# EAGLE design brick_analog_vibrator (EAGLE 7.3.0)
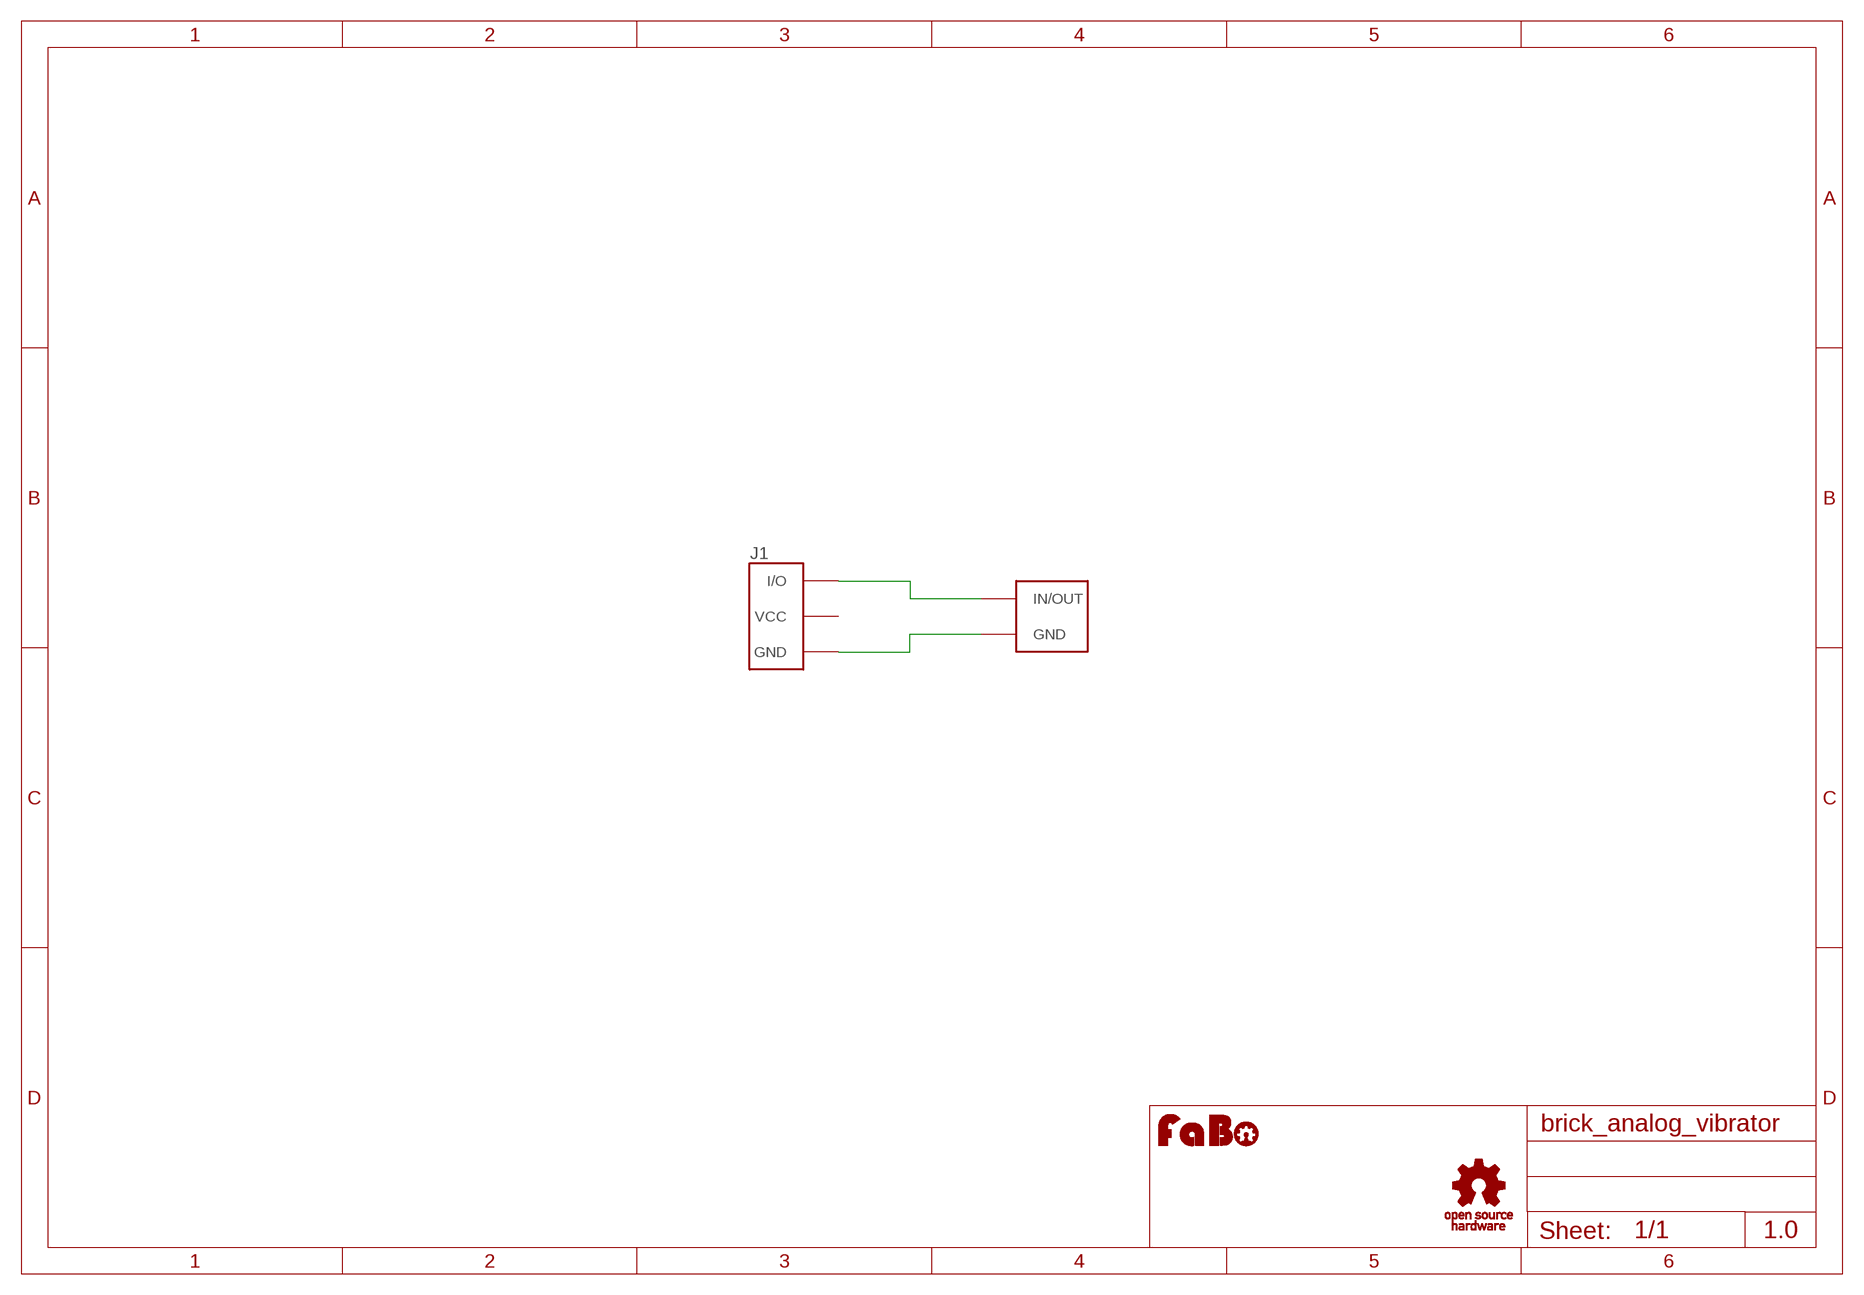
[diagram p0: schematic, sheet 1]

## Parts
J1  BRICK_3PIN_NORMAL  [BRICK_3PIN]
U1  LA3R5-480H1-PTH  [LA3R5-480AH1_PTH]
U$1  LOGO_FABO-M  [LOGO_FABO_M]
U$5  LOGO_OSHW_T-M  [LOGO_OSHW_T_M]

## Nets
GND: J1.GND U1.P$2(GND)
N$1: J1.IN/OUT(I/O) U1.P$1(IN/OUT)
Unconnected: J1.VCC

## Notes on the sheet
- 1.0

## Library data of the parts
J1 = gclue:BRICK_3PIN: FaBo Brick 3pin
U1 = gclue:LA3R5-480H1
U$1 = FaBo:LOGO_FABO
U$5 = gclue:LOGO_OSHW_T

## Board
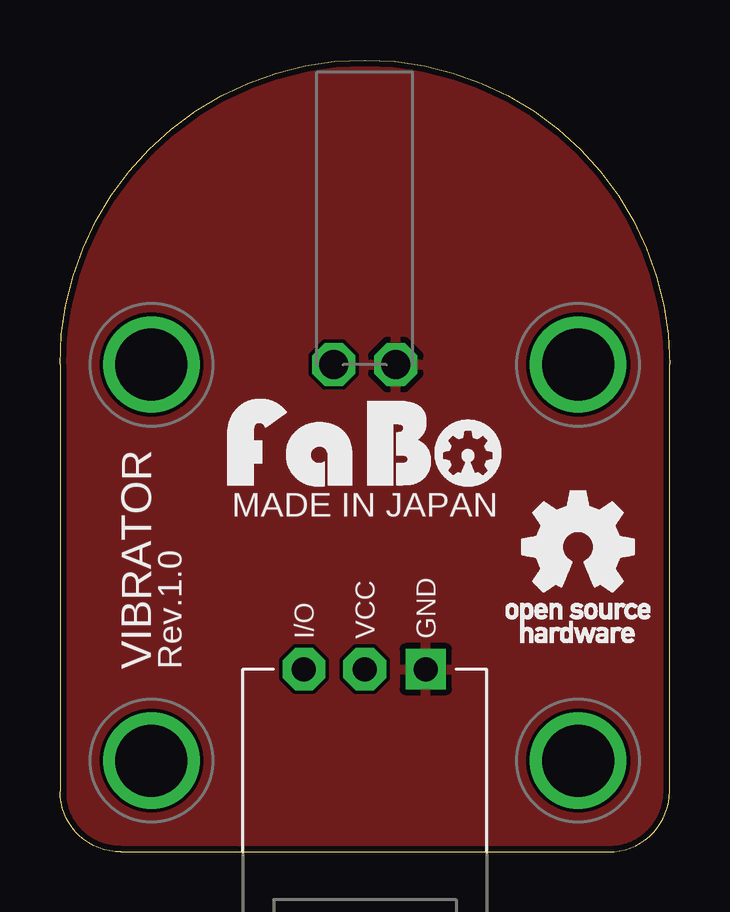
[diagram p1: board, top side]
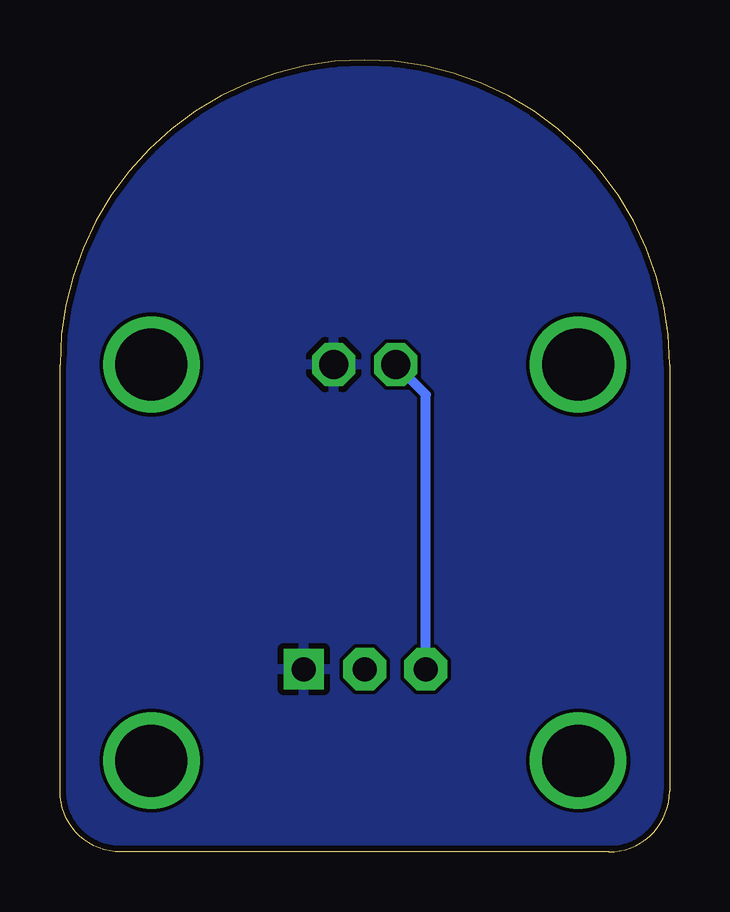
[diagram p2: board, bottom side, seen from below]

Size 25.4 x 33.02 mm. Coordinates in mm from the lower left corner, seen from the top.
Copper layers (1*16): Top 0.035mm / dielectric 1.5mm / Bottom 0.035mm
Design rules "Elecrow_2-layer_eagle_rule": minimum track width 6mil, minimum drill 12mil, track to track 6mil, track to pad 6mil, pad to pad 6mil, via to via 6mil, smd to smd 0mil, copper to edge 10mil, drill to drill 10mil, minimum pad ring 10mil, minimum via ring 6mil, stop-mask expansion 2mil, vias tented up to drill 100mil, thermal gap 10mil

### Footprints (pad centres in the part's own frame; a part is rotated, then mirrored left to right if it is on the bottom)
BRICK_3PIN = drill 1 pad 1.676 square: GND 2.54,-8.89 | drill 1 pad 1.778 octagon: IN/OUT -2.54,-8.89; VCC 0,-8.89 | drill 3 pad 3.81: P$5 -8.89,3.81; P$6 8.89,3.81; P$7 -8.89,-12.7; P$8 8.89,-12.7
LA3R5-480AH1_PTH = drill 1.2 octagon: P$1 -1.29,0; P$2 1.29,0

### Placement (x,y rotation side)
J1  12.7,16.51 0 top
U1  12.7,20.32 0 top
U$1  12.7,15.24 0 top
U$5  21.59,12.7 0 top

### Tracks (layer width: path | path; a pad name or v marks a point on that pad's centre or on a via)
GND
  pour Bottom: -1.27,-1.27 26.67,-1.27 26.67,34.29 -1.27,34.29
  pour Top: -1.27,-1.27 26.67,-1.27 26.67,34.29 -1.27,34.29
N$1
  Bottom 0.406: J1.IN/OUT 10.16,19.07 U1.P$1

### Text on the board
tPlace: MADE IN JAPAN | VIBRATOR | Rev.1.0